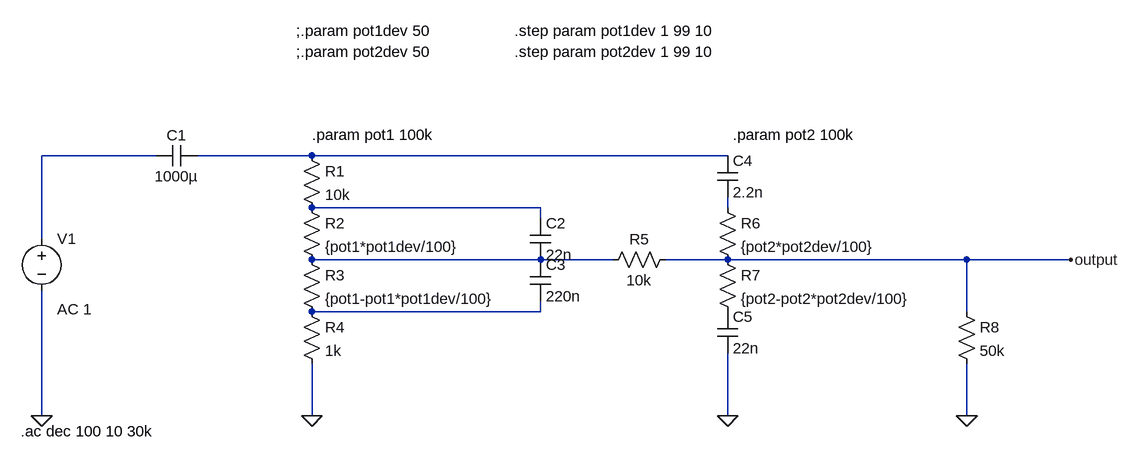
[diagram p0: schematic Baxandall tone control circuit.asc]
Baxandall tone control circuit.asc, the LTspice schematic file:
Version 4
SHEET 1 1712 680
WIRE 208 32 32 32
WIRE 448 32 272 32
WIRE 1088 32 448 32
WIRE 800 112 448 112
WIRE 1088 112 1088 96
WIRE 800 128 800 112
WIRE 32 160 32 32
WIRE 800 192 448 192
WIRE 912 192 800 192
WIRE 1088 192 992 192
WIRE 1456 192 1088 192
WIRE 1616 192 1456 192
WIRE 800 272 800 256
WIRE 800 272 448 272
WIRE 1456 272 1456 192
WIRE 32 432 32 240
WIRE 448 432 448 352
WIRE 1088 432 1088 336
WIRE 1456 432 1456 352
FLAG 32 432 0
FLAG 448 432 0
FLAG 1088 432 0
FLAG 1456 432 0
FLAG 1616 192 output
SYMBOL voltage 32 144 R0
WINDOW 123 24 124 Left 2
WINDOW 39 0 0 Left 0
SYMATTR Value2 AC 1
SYMATTR InstName V1
SYMATTR Value ""
SYMBOL cap 272 16 R90
WINDOW 0 0 32 VBottom 2
WINDOW 3 32 32 VTop 2
SYMATTR InstName C1
SYMATTR Value 1000µ
SYMBOL res 432 16 R0
SYMATTR InstName R1
SYMATTR Value 10k
SYMBOL res 432 96 R0
SYMATTR InstName R2
SYMATTR Value {pot1*pot1dev/100}
SYMBOL res 432 176 R0
SYMATTR InstName R3
SYMATTR Value {pot1-pot1*pot1dev/100}
SYMBOL res 432 256 R0
SYMATTR InstName R4
SYMATTR Value 1k
SYMBOL cap 784 128 R0
SYMATTR InstName C2
SYMATTR Value 22n
SYMBOL cap 784 192 R0
SYMATTR InstName C3
SYMATTR Value 220n
SYMBOL res 1008 176 R90
WINDOW 0 0 56 VBottom 2
WINDOW 3 32 56 VTop 2
SYMATTR InstName R5
SYMATTR Value 10k
SYMBOL cap 1072 32 R0
SYMATTR InstName C4
SYMATTR Value 2.2n
SYMBOL res 1072 96 R0
SYMATTR InstName R6
SYMATTR Value {pot2*pot2dev/100}
SYMBOL res 1072 176 R0
SYMATTR InstName R7
SYMATTR Value {pot2-pot2*pot2dev/100}
SYMBOL cap 1072 272 R0
SYMATTR InstName C5
SYMATTR Value 22n
SYMBOL res 1440 256 R0
SYMATTR InstName R8
SYMATTR Value 50k
TEXT 448 0 Left 2 !.param pot1 100k
TEXT 1096 0 Left 2 !.param pot2 100k
TEXT 424 -160 Left 2 !;.param pot1dev 50
TEXT 424 -128 Left 2 !;.param pot2dev 50
TEXT 0 456 Left 2 !.ac dec 100 10 30k
TEXT 760 -128 Left 2 !.step param pot2dev 1 99 10
TEXT 760 -160 Left 2 !.step param pot1dev 1 99 10

The netlist it stands for:
* Baxandall tone control circuit.asc
V1 N001 0 AC 1
C1 N002 N001 1000µ
R1 N002 N003 10k
R2 N003 N005 {pot1*pot1dev/100}
R3 N005 N006 {pot1-pot1*pot1dev/100}
R4 N006 0 1k
C2 N003 N005 22n
C3 N005 N006 220n
R5 output N005 10k
C4 N002 N004 2.2n
R6 N004 output {pot2*pot2dev/100}
R7 output P001 {pot2-pot2*pot2dev/100}
C5 P001 0 22n
R8 output 0 50k
.param pot1 100k
.param pot2 100k
;.param pot1dev 50
;.param pot2dev 50
.ac dec 100 10 30k
.step param pot2dev 1 99 10
.step param pot1dev 1 99 10
.backanno
.end